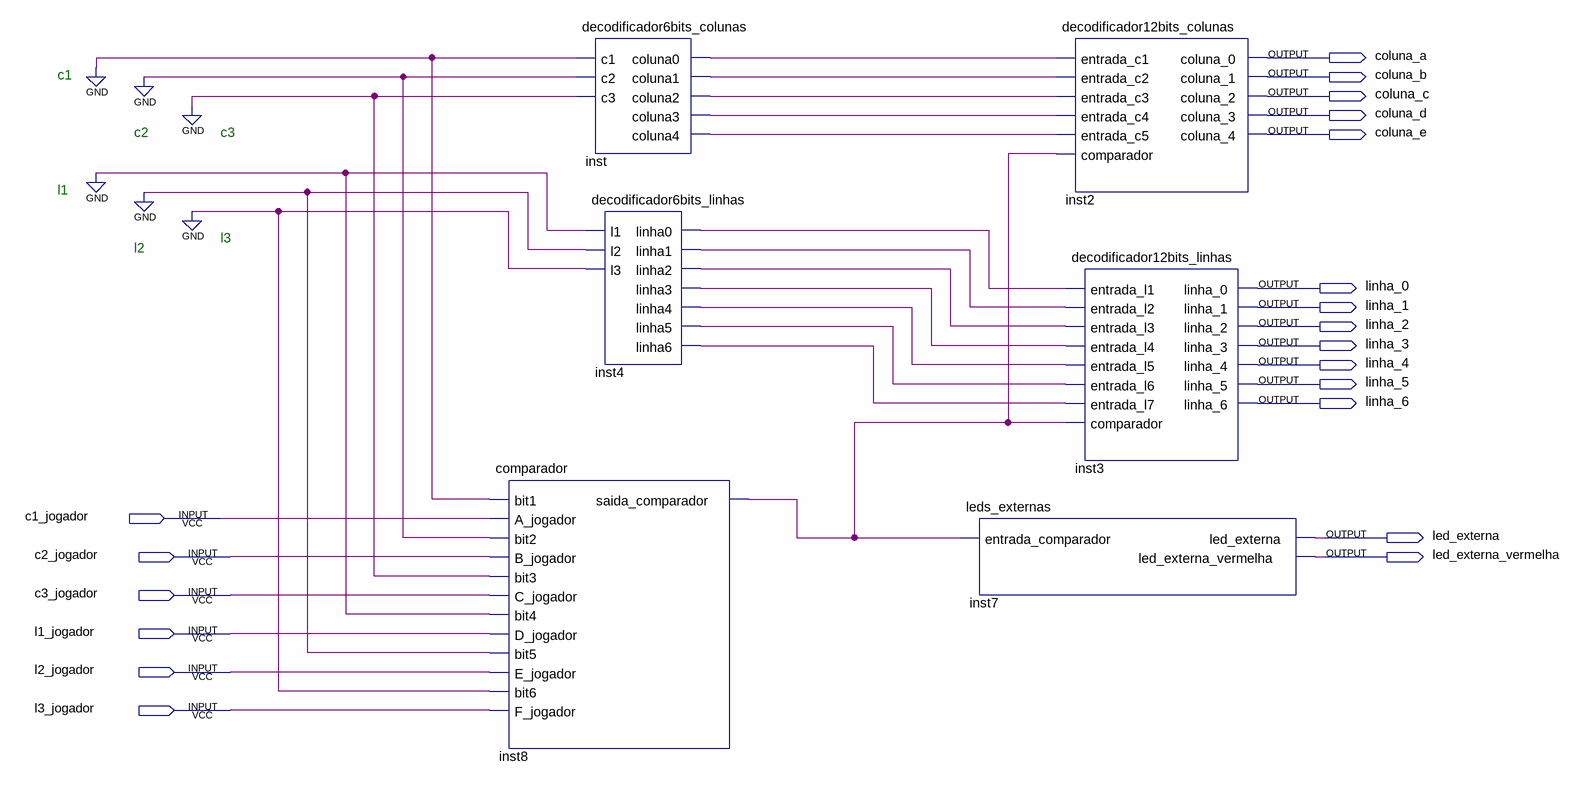
[diagram p0: schematic sheet]
// Quartus schematic PBL_decodificador.bdf as structural Verilog: 6 symbols, 20 pins
module PBL_decodificador (
  input  c1_jogador,
  input  c2_jogador,
  input  c3_jogador,
  input  l1_jogador,
  input  l2_jogador,
  input  l3_jogador,
  output coluna_a,
  output coluna_b,
  output coluna_c,
  output coluna_d,
  output coluna_e,
  output linha_0,
  output linha_1,
  output linha_2,
  output linha_3,
  output linha_4,
  output linha_5,
  output linha_6,
  output led_externa,
  output led_externa_vermelha
);

  wire inst4_linha0, inst4_linha1, inst4_linha2, inst4_linha3, inst4_linha4, inst4_linha5, inst4_linha6,
       inst8_saida_comparador, inst_coluna0, inst_coluna1, inst_coluna2, inst_coluna3, inst_coluna4;

  comparador inst8 (
    .bit1(1'b0), .A_jogador(c1_jogador), .bit2(1'b0), .B_jogador(c2_jogador), .bit3(1'b0),
    .C_jogador(c3_jogador), .bit4(1'b0), .D_jogador(l1_jogador), .bit5(1'b0), .E_jogador(l2_jogador),
    .bit6(1'b0), .F_jogador(l3_jogador), .saida_comparador(inst8_saida_comparador));
  decodificador6bits_colunas inst (
    .c1(1'b0), .c2(1'b0), .c3(1'b0), .coluna0(inst_coluna0), .coluna1(inst_coluna1), .coluna2(inst_coluna2),
    .coluna3(inst_coluna3), .coluna4(inst_coluna4));
  decodificador6bits_linhas inst4 (
    .l1(1'b0), .l2(1'b0), .l3(1'b0), .linha0(inst4_linha0), .linha1(inst4_linha1), .linha2(inst4_linha2),
    .linha3(inst4_linha3), .linha4(inst4_linha4), .linha5(inst4_linha5), .linha6(inst4_linha6));
  leds_externas inst7 (
    .entrada_comparador(inst8_saida_comparador), .led_externa(led_externa),
    .led_externa_vermelha(led_externa_vermelha));
  decodificador12bits_colunas inst2 (
    .entrada_c1(inst_coluna0), .entrada_c2(inst_coluna1), .entrada_c3(inst_coluna2),
    .entrada_c4(inst_coluna3), .entrada_c5(inst_coluna4), .comparador(inst8_saida_comparador),
    .coluna_0(coluna_a), .coluna_1(coluna_b), .coluna_2(coluna_c), .coluna_3(coluna_d), .coluna_4(coluna_e));
  decodificador12bits_linhas inst3 (
    .entrada_l1(inst4_linha0), .entrada_l2(inst4_linha1), .entrada_l3(inst4_linha2),
    .entrada_l4(inst4_linha3), .entrada_l5(inst4_linha4), .entrada_l6(inst4_linha5),
    .entrada_l7(inst4_linha6), .comparador(inst8_saida_comparador), .linha_0(linha_0), .linha_1(linha_1),
    .linha_2(linha_2), .linha_3(linha_3), .linha_4(linha_4), .linha_5(linha_5), .linha_6(linha_6));

  // Notes on the sheet:
  //   c1
  //   c2
  //   c3
  //   l1
  //   l3
  //   l2
endmodule
